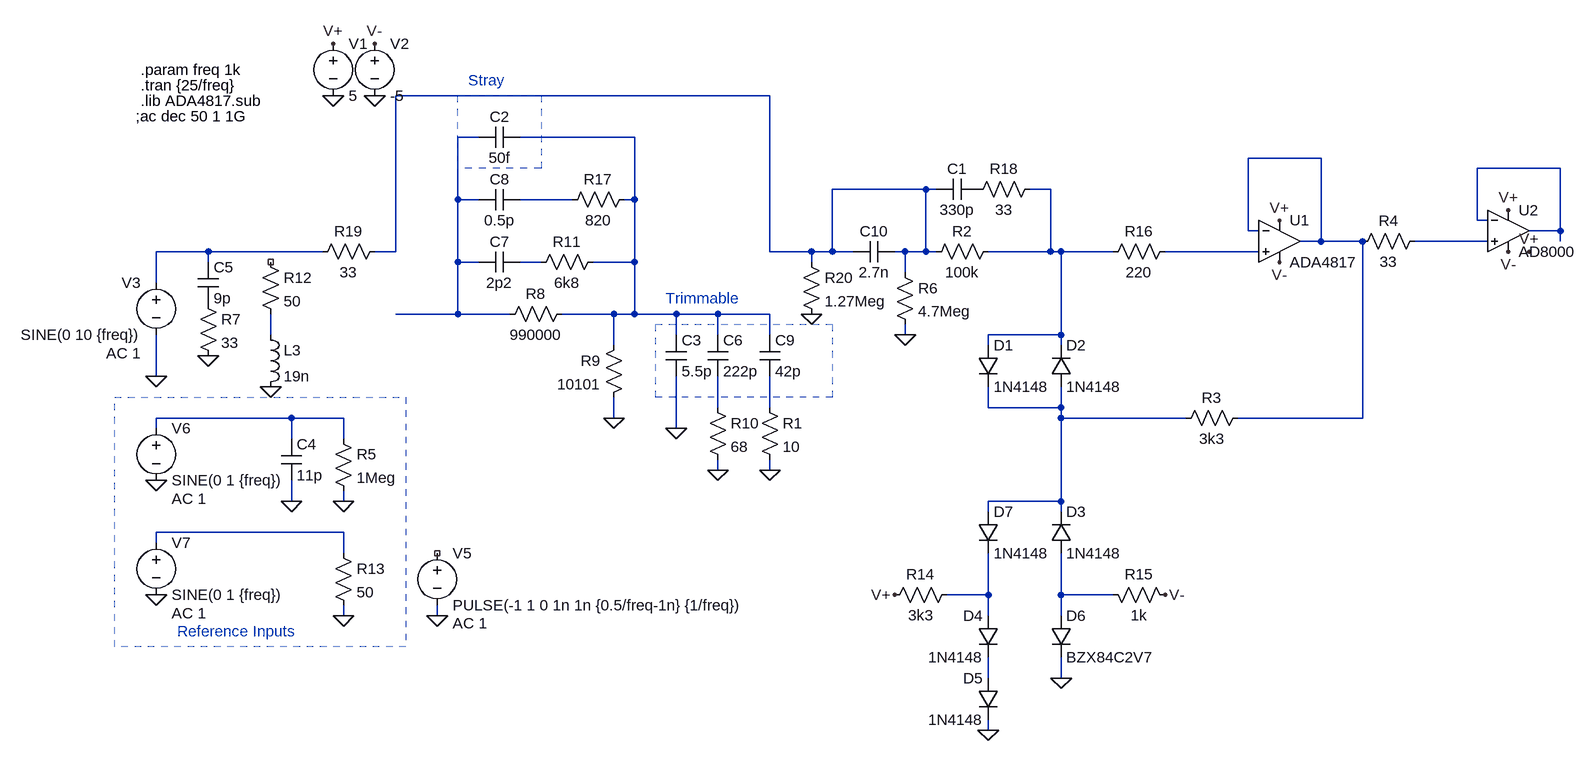
[diagram p0: schematic input.asc]
input.asc, the LTspice schematic file:
Version 4
SHEET 1 2084 772
WIRE 800 -224 224 -224
WIRE 352 -160 320 -160
WIRE 592 -160 416 -160
WIRE 1648 -128 1536 -128
WIRE 2016 -112 1888 -112
WIRE 1040 -80 896 -80
WIRE 1056 -80 1040 -80
WIRE 1232 -80 1200 -80
WIRE 320 -64 320 -160
WIRE 352 -64 320 -64
WIRE 496 -64 416 -64
WIRE 592 -64 592 -160
WIRE 592 -64 576 -64
WIRE 1888 -32 1888 -112
WIRE 1904 -32 1888 -32
WIRE 1536 -16 1536 -128
WIRE 1552 -16 1536 -16
WIRE 2016 -16 2016 -112
WIRE 2016 -16 1968 -16
WIRE 1648 0 1648 -128
WIRE 1648 0 1616 0
WIRE 1712 0 1648 0
WIRE 1904 0 1792 0
WIRE 2016 0 2016 -16
WIRE -64 16 -144 16
WIRE 112 16 -64 16
WIRE 224 16 224 -224
WIRE 224 16 192 16
WIRE 800 16 800 -224
WIRE 864 16 800 16
WIRE 896 16 896 -80
WIRE 896 16 864 16
WIRE 928 16 896 16
WIRE 1008 16 992 16
WIRE 1040 16 1040 -80
WIRE 1040 16 1008 16
WIRE 1056 16 1040 16
WIRE 1232 16 1232 -80
WIRE 1232 16 1136 16
WIRE 1248 16 1232 16
WIRE 1328 16 1248 16
WIRE 1552 16 1408 16
WIRE -64 32 -64 16
WIRE 320 32 320 -64
WIRE 352 32 320 32
WIRE 448 32 416 32
WIRE 592 32 592 -64
WIRE 592 32 528 32
WIRE 864 32 864 16
WIRE 1008 48 1008 16
WIRE -144 64 -144 16
WIRE 320 112 320 32
WIRE 320 112 224 112
WIRE 400 112 320 112
WIRE 560 112 480 112
WIRE 592 112 592 32
WIRE 592 112 560 112
WIRE 656 112 592 112
WIRE 720 112 656 112
WIRE 800 112 720 112
WIRE 32 144 32 112
WIRE 656 144 656 112
WIRE 720 144 720 112
WIRE 800 144 800 112
WIRE 1008 144 1008 128
WIRE 1248 144 1248 16
WIRE 1248 144 1136 144
WIRE 560 160 560 112
WIRE 1136 160 1136 144
WIRE 1248 160 1248 144
WIRE -144 208 -144 144
WIRE 720 256 720 208
WIRE 800 256 800 208
WIRE 1136 256 1136 224
WIRE 1248 256 1248 224
WIRE 1248 256 1136 256
WIRE 64 272 -144 272
WIRE 144 272 64 272
WIRE 560 272 560 240
WIRE 1248 272 1248 256
WIRE 1440 272 1248 272
WIRE 1712 272 1712 0
WIRE 1712 272 1520 272
WIRE -144 288 -144 272
WIRE 656 288 656 208
WIRE 64 304 64 272
WIRE 144 304 144 272
WIRE 720 352 720 336
WIRE 800 352 800 336
WIRE 64 400 64 368
WIRE 144 400 144 384
WIRE 1248 400 1248 272
WIRE 1248 400 1136 400
WIRE 1136 416 1136 400
WIRE 1248 416 1248 400
WIRE 144 448 -144 448
WIRE -144 464 -144 448
WIRE 144 480 144 448
WIRE 1136 544 1136 480
WIRE 1136 544 1072 544
WIRE 1248 544 1248 480
WIRE 1328 544 1248 544
WIRE 144 576 144 560
WIRE 288 576 288 560
WIRE 1136 576 1136 544
WIRE 1248 576 1248 544
WIRE 1136 672 1136 640
WIRE 1248 672 1248 640
WIRE 1136 752 1136 736
FLAG 128 -224 0
FLAG 128 -304 V+
FLAG 1584 -32 V+
FLAG 192 -224 0
FLAG 192 -304 V-
FLAG 1584 32 V-
FLAG 1248 672 0
FLAG -144 208 0
FLAG -144 368 0
FLAG 64 400 0
FLAG 144 400 0
FLAG -64 176 0
FLAG 560 272 0
FLAG 720 352 0
FLAG -144 544 0
FLAG 144 576 0
FLAG 32 224 0
FLAG 800 352 0
FLAG 992 544 V+
FLAG 1408 544 V-
FLAG 1936 -48 V+
FLAG 1968 16 V+
FLAG 1936 16 V-
FLAG 288 576 0
FLAG 656 288 0
FLAG 1008 144 0
FLAG 864 112 0
FLAG 1136 752 0
SYMBOL Opamps\\opamp2 1584 -64 R0
SYMATTR InstName U1
SYMATTR Value ADA4817
SYMBOL voltage 128 -320 R0
WINDOW 123 0 0 Left 2
WINDOW 39 0 0 Left 2
SYMATTR InstName V1
SYMATTR Value 5
SYMBOL voltage 192 -320 R0
WINDOW 123 0 0 Left 2
WINDOW 39 0 0 Left 2
SYMATTR InstName V2
SYMATTR Value -5
SYMBOL diode 1120 160 R0
SYMATTR InstName D1
SYMATTR Value 1N4148
SYMBOL diode 1232 224 M180
WINDOW 0 24 64 Left 2
WINDOW 3 24 0 Left 2
SYMATTR InstName D2
SYMATTR Value 1N4148
SYMBOL res 1152 0 R90
WINDOW 0 0 56 VBottom 2
WINDOW 3 32 56 VTop 2
SYMATTR InstName R2
SYMATTR Value 100k
SYMBOL cap 1120 -96 R90
WINDOW 0 0 32 VBottom 2
WINDOW 3 32 32 VTop 2
SYMATTR InstName C1
SYMATTR Value 330p
SYMBOL voltage 288 464 R0
WINDOW 123 24 124 Left 2
WINDOW 39 0 0 Left 2
SYMATTR Value2 AC 1
SYMATTR InstName V5
SYMATTR Value PULSE(-1 1 0 1n 1n {0.5/freq-1n} {1/freq})
SYMBOL diode 1232 480 M180
WINDOW 0 24 64 Left 2
WINDOW 3 24 0 Left 2
SYMATTR InstName D3
SYMATTR Value 1N4148
SYMBOL diode 1152 576 M0
SYMATTR InstName D4
SYMATTR Value 1N4148
SYMBOL res 1536 256 R90
WINDOW 0 0 56 VBottom 2
WINDOW 3 32 56 VTop 2
SYMATTR InstName R3
SYMATTR Value 3k3
SYMBOL voltage -144 272 R0
WINDOW 123 24 124 Left 2
WINDOW 39 0 0 Left 2
SYMATTR Value2 AC 1
SYMATTR InstName V6
SYMATTR Value SINE(0 1 {freq})
SYMBOL cap 48 304 R0
SYMATTR InstName C4
SYMATTR Value 11p
SYMBOL res 128 288 R0
SYMATTR InstName R5
SYMATTR Value 1Meg
SYMBOL cap -80 32 R0
SYMATTR InstName C5
SYMATTR Value 9p
SYMBOL res -80 80 R0
SYMATTR InstName R7
SYMATTR Value 33
SYMBOL res 496 96 R90
WINDOW 0 0 56 VBottom 2
WINDOW 3 32 56 VTop 2
SYMATTR InstName R8
SYMATTR Value 990000
SYMBOL res 576 144 M0
SYMATTR InstName R9
SYMATTR Value 10101
SYMBOL cap 704 144 R0
SYMATTR InstName C6
SYMATTR Value 222p
SYMBOL res 704 240 R0
SYMATTR InstName R10
SYMATTR Value 68
SYMBOL cap 416 16 R90
WINDOW 0 0 32 VBottom 2
WINDOW 3 32 32 VTop 2
SYMATTR InstName C7
SYMATTR Value 2p2
SYMBOL res 544 16 R90
WINDOW 0 0 56 VBottom 2
WINDOW 3 32 56 VTop 2
SYMATTR InstName R11
SYMATTR Value 6k8
SYMBOL res 16 16 R0
SYMATTR InstName R12
SYMATTR Value 50
SYMBOL voltage -144 448 R0
WINDOW 123 24 124 Left 2
WINDOW 39 0 0 Left 2
SYMATTR Value2 AC 1
SYMATTR InstName V7
SYMATTR Value SINE(0 1 {freq})
SYMBOL res 128 464 R0
SYMATTR InstName R13
SYMATTR Value 50
SYMBOL ind 16 128 R0
SYMATTR InstName L3
SYMATTR Value 19n
SYMBOL cap 416 -80 R90
WINDOW 0 0 32 VBottom 2
WINDOW 3 32 32 VTop 2
SYMATTR InstName C8
SYMATTR Value 0.5p
SYMBOL cap 784 144 R0
SYMATTR InstName C9
SYMATTR Value 42p
SYMBOL diode 1232 576 R0
SYMATTR InstName D6
SYMATTR Value BZX84C2V7
SYMBOL res 1088 528 R90
WINDOW 0 0 56 VBottom 2
WINDOW 3 32 56 VTop 2
SYMATTR InstName R14
SYMATTR Value 3k3
SYMBOL res 1312 528 M90
WINDOW 0 0 56 VBottom 2
WINDOW 3 32 56 VTop 2
SYMATTR InstName R15
SYMATTR Value 1k
SYMBOL res 1424 0 R90
WINDOW 0 0 56 VBottom 2
WINDOW 3 32 56 VTop 2
SYMATTR InstName R16
SYMATTR Value 220
SYMBOL res 1808 -16 R90
WINDOW 0 0 56 VBottom 2
WINDOW 3 32 56 VTop 2
SYMATTR InstName R4
SYMATTR Value 33
SYMBOL Opamps\\AD\\AD8000 1936 -80 R0
SYMATTR InstName U2
SYMBOL voltage -144 48 M0
WINDOW 123 24 124 Left 2
WINDOW 39 0 0 Left 2
SYMATTR Value2 AC 1
SYMATTR InstName V3
SYMATTR Value SINE(0 10 {freq})
SYMBOL diode 1120 416 R0
SYMATTR InstName D7
SYMATTR Value 1N4148
SYMBOL res 784 240 R0
SYMATTR InstName R1
SYMATTR Value 10
SYMBOL res 592 -80 R90
WINDOW 0 0 56 VBottom 2
WINDOW 3 32 56 VTop 2
SYMATTR InstName R17
SYMATTR Value 820
SYMBOL cap 416 -176 R90
WINDOW 0 0 32 VBottom 2
WINDOW 3 32 32 VTop 2
SYMATTR InstName C2
SYMATTR Value 50f
SYMBOL cap 640 144 R0
SYMATTR InstName C3
SYMATTR Value 5.5p
SYMBOL cap 992 0 R90
WINDOW 0 0 32 VBottom 2
WINDOW 3 32 32 VTop 2
SYMATTR InstName C10
SYMATTR Value 2.7n
SYMBOL res 992 32 R0
SYMATTR InstName R6
SYMATTR Value 4.7Meg
SYMBOL res 208 0 R90
WINDOW 0 0 56 VBottom 2
WINDOW 3 32 56 VTop 2
SYMATTR InstName R19
SYMATTR Value 33
SYMBOL res 1216 -96 R90
WINDOW 0 0 56 VBottom 2
WINDOW 3 32 56 VTop 2
SYMATTR InstName R18
SYMATTR Value 33
SYMBOL res 848 16 R0
SYMATTR InstName R20
SYMATTR Value 1.27Meg
SYMBOL diode 1152 672 M0
SYMATTR InstName D5
SYMATTR Value 1N4148
TEXT -168 -264 Left 2 !.param freq 1k
TEXT -168 -240 Left 2 !.tran {25/freq}
TEXT -168 -216 Left 2 !.lib ADA4817.sub
TEXT -176 -192 Left 2 !;ac dec 50 1 1G
TEXT -112 600 Left 2 ;Reference Inputs
TEXT 336 -248 Left 2 ;Stray
TEXT 640 88 Left 2 ;Trimmable
RECTANGLE Normal 240 624 -208 240 2
RECTANGLE Normal 448 -112 320 -224 2
RECTANGLE Normal 896 240 624 128 2

The netlist it stands for:
* input.asc
XU1 N010 N004 V+ V- N004 ADA4817  ; pins In+ In- V+ V- OUT
V1 V+ 0 5
V2 V- 0 -5
D1 N006 N015 1N4148
D2 N015 N006 1N4148
R2 N006 N001 100k
C1 P001 N001 330p
V5 NC_01 0 PULSE(-1 1 0 1n 1n {0.5/freq-1n} {1/freq}) AC 1
D3 N019 N015 1N4148
D4 N018 N020 1N4148
R3 N004 N015 3k3
V6 N016 0 SINE(0 1 {freq}) AC 1
C4 N016 0 11p
R5 N016 0 1Meg
C5 N009 P002 9p
R7 P002 0 33
R8 N003 N002 990000
R9 N003 0 10101
C6 N003 N013 222p
R10 N013 0 68
C7 N011 N002 2p2
R11 N003 N011 6k8
R12 NC_02 N012 50
V7 N017 0 SINE(0 1 {freq}) AC 1
R13 N017 0 50
L3 N012 0 19n
C8 N007 N002 0.5p
C9 N003 N014 42p
D6 N019 0 BZX84C2V7
R14 N018 V+ 3k3
R15 N019 V- 1k
R16 N010 N006 220
R4 N008 N004 33
XU2 N008 N005 V+ V- N005 AD8000  ; pins In+ In- V+ V- OUT
V3 N009 0 SINE(0 10 {freq}) AC 1
D7 N015 N018 1N4148
R1 N014 0 10
R17 N003 N007 820
C2 N003 N002 50f
C3 N003 0 5.5p
C10 N001 N001 2.7n
R6 N001 0 4.7Meg
R19 N001 N009 33
R18 N006 P001 33
R20 N001 0 1.27Meg
D5 N020 0 1N4148
.model D D
.lib standard.dio
.param freq 1k
.tran {25/freq}
.lib ADA4817.sub
;ac dec 50 1 1G
* Reference Inputs
* Stray
* Trimmable
.backanno
.end